# EAGLE schematic DashCam Schematic (EAGLE 8.0.2)
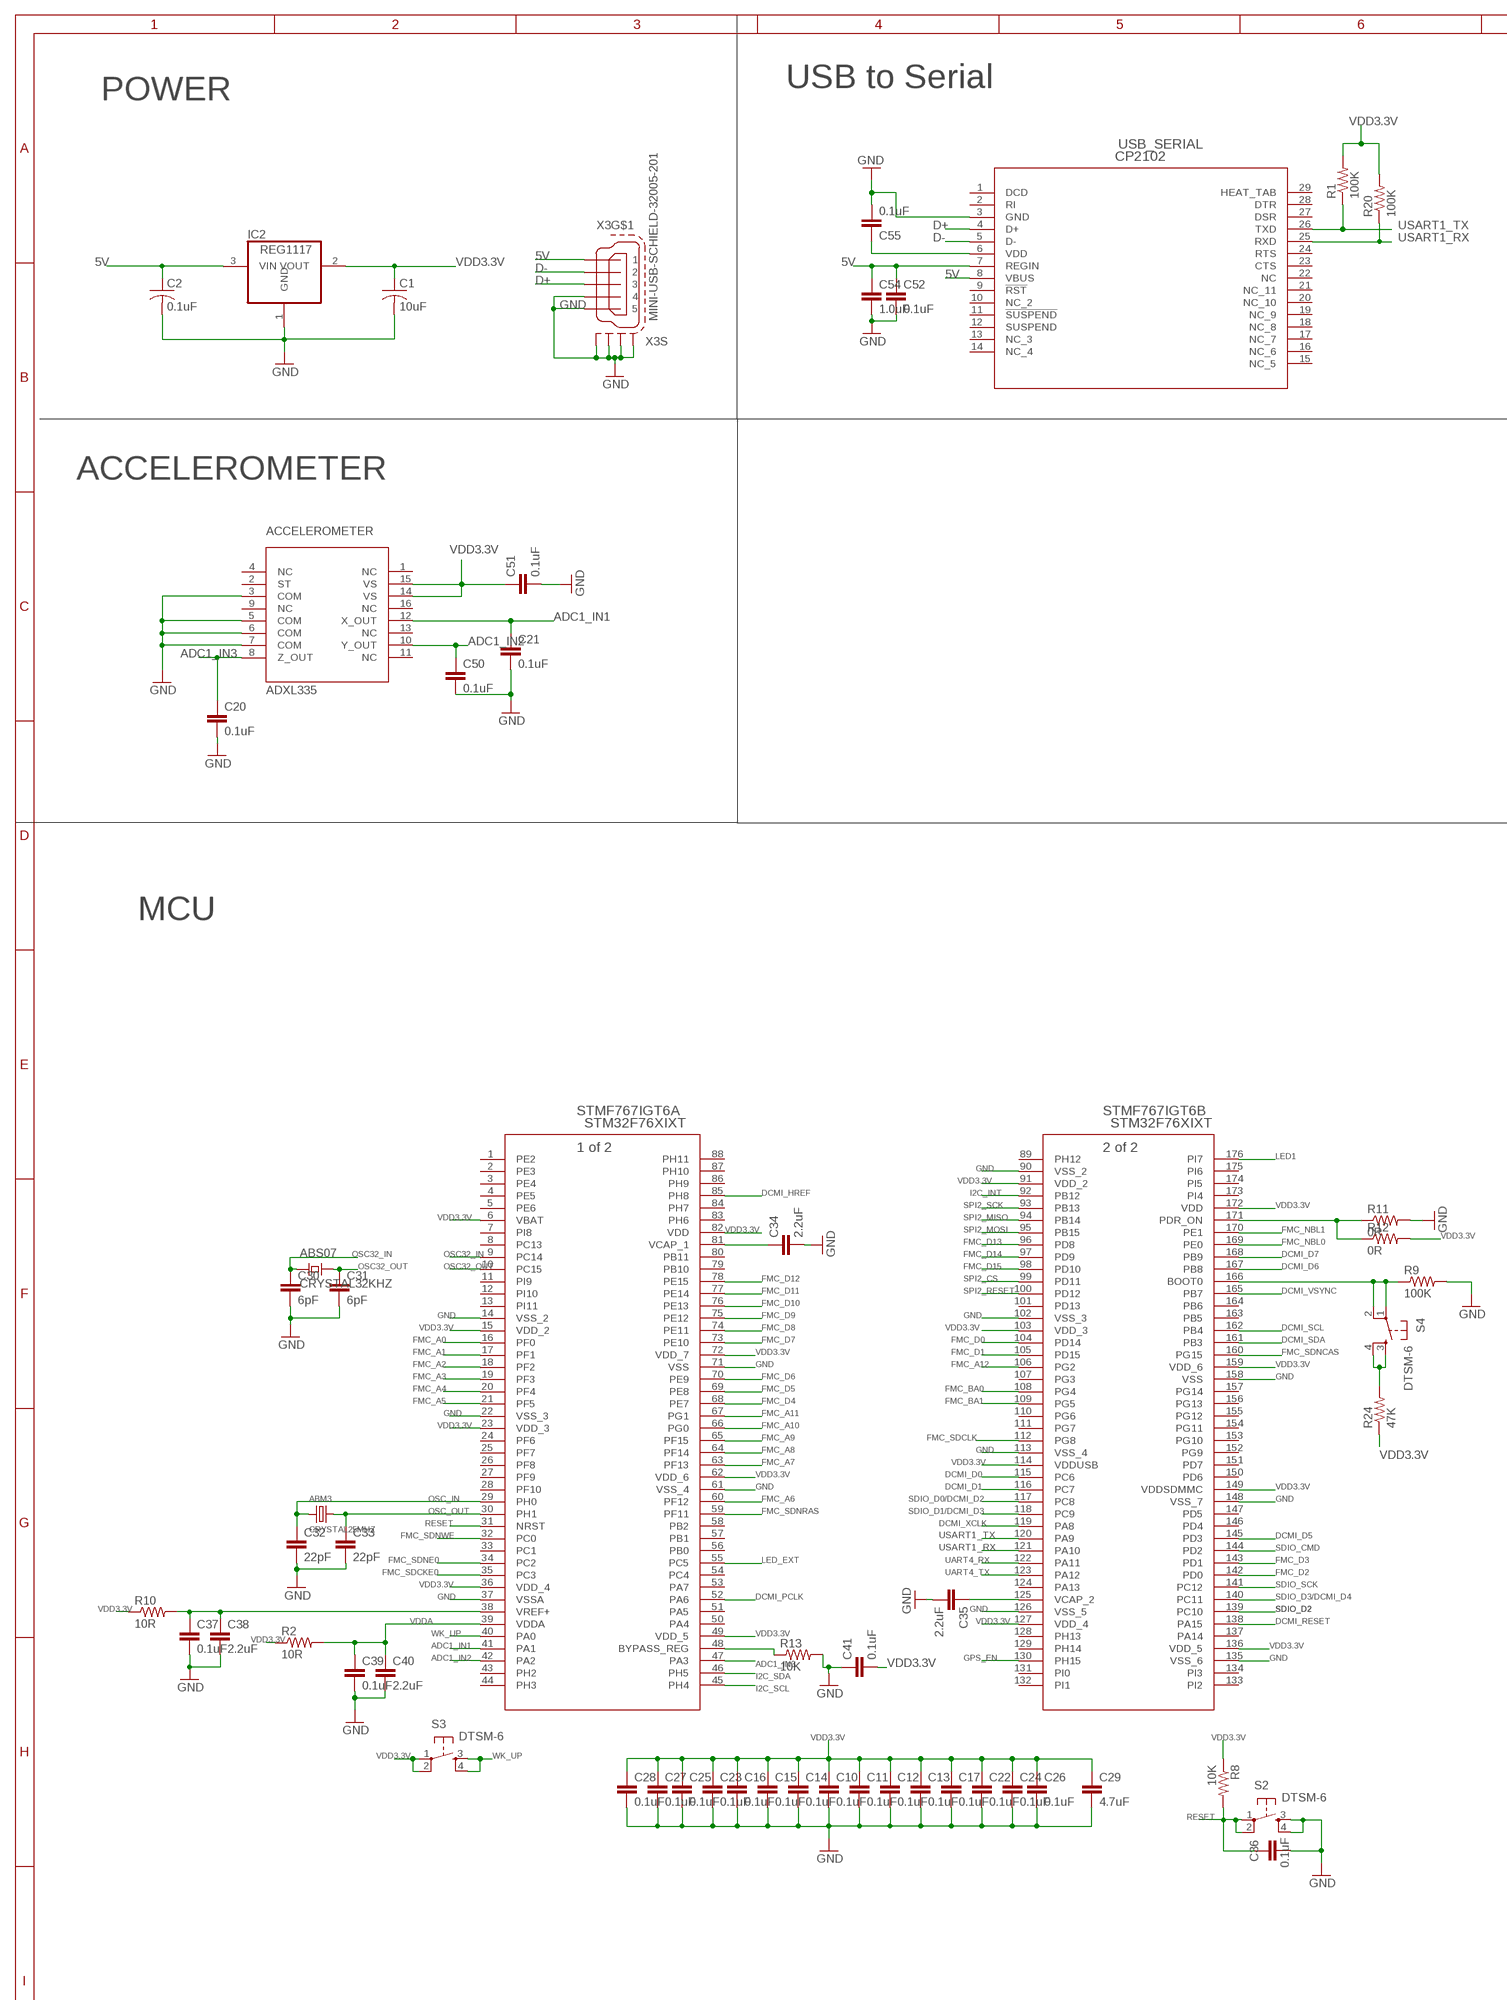
[diagram p0: schematic, sheet 1, part 1 of 2]
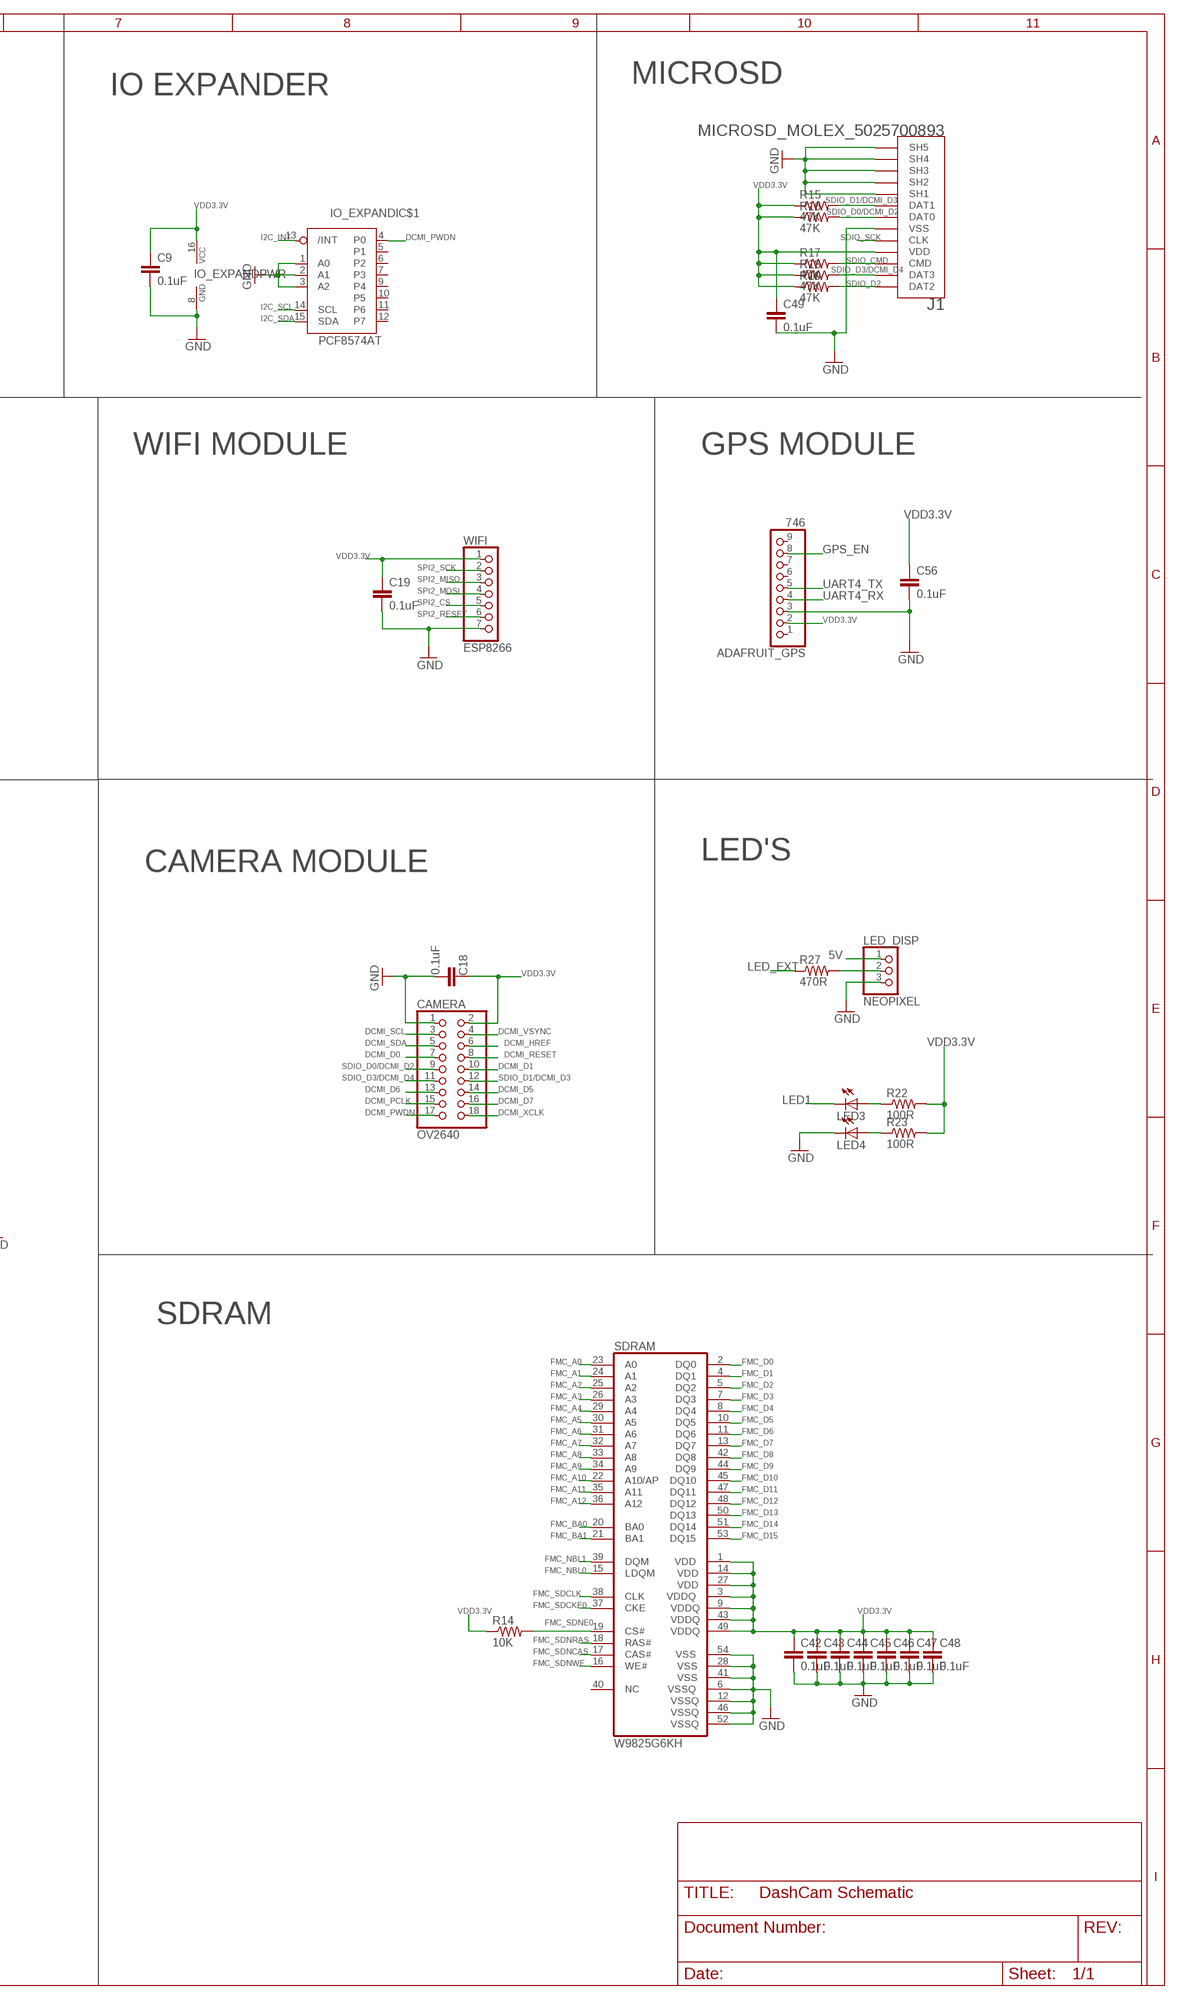
[diagram p1: schematic, sheet 1, part 2 of 2]

## Parts
ABM3  CRYSTAL25MHZ  CRYSTAL.6X3.3MM  [6X3.3MM]
ABS07  CRYSTAL32KHZ  ABSO7  [2-SMD_ABM7]
ACCELEROMETER  ADXL335  [LFCSP16]
ADAFRUIT_GPS  746  PINHD-1X9  [1X09]
C1  10uF  C-USC0805  [C0805]
C2  0.1uF  C-USC0402  [C0402]
C9  0.1uF  C-EUC0402  [C0402]
C10  0.1uF  C-EUC0402  [C0402]
C11  0.1uF  C-EUC0402  [C0402]
C12  0.1uF  C-EUC0402  [C0402]
C13  0.1uF  C-EUC0402  [C0402]
C14  0.1uF  C-EUC0402  [C0402]
C15  0.1uF  C-EUC0402  [C0402]
C16  0.1uF  C-EUC0402  [C0402]
C17  0.1uF  C-EUC0402  [C0402]
C18  0.1uF  C-EUC0402  [C0402]
C19  0.1uF  C-EUC0402  [C0402]
C20  0.1uF  C-EUC0402  [C0402]
C21  0.1uF  C-EUC0402  [C0402]
C22  0.1uF  C-EUC0402  [C0402]
C23  0.1uF  C-EUC0402  [C0402]
C24  0.1uF  C-EUC0402  [C0402]
C25  0.1uF  C-EUC0402  [C0402]
C26  0.1uF  C-EUC0402  [C0402]
C27  0.1uF  C-EUC0402  [C0402]
C28  0.1uF  C-EUC0402  [C0402]
C29  4.7uF  C-EUC0603  [C0603]
C30  6pF  C-EUC0402  [C0402]
C31  6pF  C-EUC0402  [C0402]
C32  22pF  C-EUC0201  [C0201]
C33  22pF  C-EUC0201  [C0201]
C34  2.2uF  C-EUC0805  [C0805]
C35  2.2uF  C-EUC0805  [C0805]
C36  0.1uF  C-EUC0402  [C0402]
C37  0.1uF  C-EUC0402  [C0402]
C38  2.2uF  C-EUC0805  [C0805]
C39  0.1uF  C-EUC0402  [C0402]
C40  2.2uF  C-EUC0805  [C0805]
C41  0.1uF  C-EUC0402  [C0402]
C42  0.1uF  C-EUC0402  [C0402]
C43  0.1uF  C-EUC0402  [C0402]
C44  0.1uF  C-EUC0402  [C0402]
C45  0.1uF  C-EUC0402  [C0402]
C46  0.1uF  C-EUC0402  [C0402]
C47  0.1uF  C-EUC0402  [C0402]
C48  0.1uF  C-EUC0402  [C0402]
C49  0.1uF  C-EUC0402  [C0402]
C50  0.1uF  C-EUC0402  [C0402]
C51  0.1uF  C-EUC0402  [C0402]
C52  0.1uF  C-EUC0402  [C0402]
C54  1.0uF  C-EUC0402  [C0402]
C55  0.1uF  C-EUC0402  [C0402]
C56  0.1uF  C-EUC0402  [C0402]
CAMERA  OV2640  PINHD-2X9/90  [2X09/90]
IC2  REG1117  [SOT223]
IO_EXPAND  PCF8574AT  [SO16]
J1  MICROSD_MOLEX_5025700893  [5025700893]
LED3  LEDCHIP-LED0603  [CHIP-LED0603]
LED4  LEDCHIP-LED0603  [CHIP-LED0603]
LED_DISP  NEOPIXEL  PINHD-1X3  [1X03]
R1  100K  R-US_R0805  [R0805]
R2  10R  R-US_R0603  [R0603]
R8  10K  R-US_R0402  [R0402]
R9  100K  R-US_R0805  [R0805]
R10  10R  R-US_R0603  [R0603]
R11  0R  R-US_R0402  [R0402]
R12  0R  R-US_R0402  [R0402]
R13  10K  R-US_R0402  [R0402]
R14  10K  R-US_R0402  [R0402]
R15  47K  R-US_R0402  [R0402]
R16  47K  R-US_R0402  [R0402]
R17  47K  R-US_R0402  [R0402]
R18  47K  R-US_R0402  [R0402]
R19  47K  R-US_R0402  [R0402]
R20  100K  R-US_R0805  [R0805]
R22  100R  R-US_R0402  [R0402]
R23  100R  R-US_R0402  [R0402]
R24  47K  R-US_R0402  [R0402]
R27  470R  R-US_R0603  [R0603]
S2  DTSM-6  [DTSM-6]
S3  DTSM-6  [DTSM-6]
S4  DTSM-6  [DTSM-6]
SDRAM  W9825G6KH  K4S561632E-TC  [TSOP54]
STMF767IGT6  STM32F76XIXT  [LQFP-176_24X24]
USB_SERIAL  CP2102  [QFN28N5X5-0P5P]
WIFI  ESP8266  PINHD-1X7  [1X07]
X3  MINI-USB-SCHIELD-32005-201  [32005-201]

## Nets
5V: C2.1 C52.1 C54.1 IC2.3(VIN) LED_DISP.1 USB_SERIAL.7(REGIN) USB_SERIAL.8(VBUS) X3.1
ADC1_IN1: ACCELEROMETER.12(X_OUT) C21.1 STMF767IGT6.41(A:PA1)
ADC1_IN2: ACCELEROMETER.10(Y_OUT) C50.1 STMF767IGT6.42(A:PA2)
ADC1_IN3: ACCELEROMETER.8(Z_OUT) C20.1 STMF767IGT6.47(A:PA3)
D+: USB_SERIAL.4(D+) X3.3
D-: USB_SERIAL.5(D-) X3.2
DCMI_D0: CAMERA.7 STMF767IGT6.115(B:PC6)
DCMI_D1: CAMERA.10 STMF767IGT6.116(B:PC7)
DCMI_D5: CAMERA.14 STMF767IGT6.145(B:PD3)
DCMI_D6: CAMERA.13 STMF767IGT6.167(B:PB8)
DCMI_D7: CAMERA.16 STMF767IGT6.168(B:PB9)
DCMI_HREF: CAMERA.6 STMF767IGT6.85(A:PH8)
DCMI_PCLK: CAMERA.15 STMF767IGT6.52(A:PA6)
DCMI_PWDN: CAMERA.17 IO_EXPAND.4(IC$1:P0)
DCMI_RESET: CAMERA.8 STMF767IGT6.138(B:PA15)
DCMI_SCL: CAMERA.3 STMF767IGT6.162(B:PB4)
DCMI_SDA: CAMERA.5 STMF767IGT6.161(B:PB3)
DCMI_VSYNC: CAMERA.4 STMF767IGT6.165(B:PB7)
DCMI_XCLK: CAMERA.18 STMF767IGT6.119(B:PA8)
FMC_A0: SDRAM.23(A0) STMF767IGT6.16(A:PF0)
FMC_A1: SDRAM.24(A1) STMF767IGT6.17(A:PF1)
FMC_A2: SDRAM.25(A2) STMF767IGT6.18(A:PF2)
FMC_A3: SDRAM.26(A3) STMF767IGT6.19(A:PF3)
FMC_A4: SDRAM.29(A4) STMF767IGT6.20(A:PF4)
FMC_A5: SDRAM.30(A5) STMF767IGT6.21(A:PF5)
FMC_A6: SDRAM.31(A6) STMF767IGT6.60(A:PF12)
FMC_A7: SDRAM.32(A7) STMF767IGT6.63(A:PF13)
FMC_A8: SDRAM.33(A8) STMF767IGT6.64(A:PF14)
FMC_A9: SDRAM.34(A9) STMF767IGT6.65(A:PF15)
FMC_A10: SDRAM.22(A10/AP) STMF767IGT6.66(A:PG0)
FMC_A11: SDRAM.35(A11) STMF767IGT6.67(A:PG1)
FMC_A12: SDRAM.36(A12) STMF767IGT6.106(B:PG2)
FMC_BA0: SDRAM.20(BA0) STMF767IGT6.108(B:PG4)
FMC_BA1: SDRAM.21(BA1) STMF767IGT6.109(B:PG5)
FMC_D0: SDRAM.2(DQ0) STMF767IGT6.104(B:PD14)
FMC_D1: SDRAM.4(DQ1) STMF767IGT6.105(B:PD15)
FMC_D2: SDRAM.5(DQ2) STMF767IGT6.142(B:PD0)
FMC_D3: SDRAM.7(DQ3) STMF767IGT6.143(B:PD1)
FMC_D4: SDRAM.8(DQ4) STMF767IGT6.68(A:PE7)
FMC_D5: SDRAM.10(DQ5) STMF767IGT6.69(A:PE8)
FMC_D6: SDRAM.11(DQ6) STMF767IGT6.70(A:PE9)
FMC_D7: SDRAM.13(DQ7) STMF767IGT6.73(A:PE10)
FMC_D8: SDRAM.42(DQ8) STMF767IGT6.74(A:PE11)
FMC_D9: SDRAM.44(DQ9) STMF767IGT6.75(A:PE12)
FMC_D10: SDRAM.45(DQ10) STMF767IGT6.76(A:PE13)
FMC_D11: SDRAM.47(DQ11) STMF767IGT6.77(A:PE14)
FMC_D12: SDRAM.48(DQ12) STMF767IGT6.78(A:PE15)
FMC_D13: SDRAM.50(DQ13) STMF767IGT6.96(B:PD8)
FMC_D14: SDRAM.51(DQ14) STMF767IGT6.97(B:PD9)
FMC_D15: SDRAM.53(DQ15) STMF767IGT6.98(B:PD10)
FMC_NBL0: SDRAM.15(LDQM) STMF767IGT6.169(B:PE0)
FMC_NBL1: SDRAM.39(DQM) STMF767IGT6.170(B:PE1)
FMC_SDCKE0: SDRAM.37(CKE) STMF767IGT6.35(A:PC3)
FMC_SDCLK: SDRAM.38(CLK) STMF767IGT6.112(B:PG8)
FMC_SDNCAS: SDRAM.17(CAS#) STMF767IGT6.160(B:PG15)
FMC_SDNE0: R14.2 SDRAM.19(CS#) STMF767IGT6.34(A:PC2)
FMC_SDNRAS: SDRAM.18(RAS#) STMF767IGT6.59(A:PF11)
FMC_SDNWE: SDRAM.16(WE#) STMF767IGT6.32(A:PC0)
GND: ACCELEROMETER.3(COM) ACCELEROMETER.5(COM) ACCELEROMETER.6(COM) ACCELEROMETER.7(COM) ADAFRUIT_GPS.3 C1.2 C2.2 C9.2 C10.2 C11.2 C12.2 C13.2 C14.2 C15.2 C16.2 C17.2 C18.2 C19.2 C20.2 C21.2 C22.2 C23.2 C24.2 C25.2 C26.2 C27.2 C28.2 C29.2 C30.2 C31.2 C32.2 C33.2 C34.2 C35.2 C36.2 C37.2 C38.2 C39.2 C40.2 C41.1 C42.2 C43.2 C44.2 C45.2 C46.2 C47.2 C48.2 C49.2 C50.2 C51.2 C52.2 C54.2 C55.2 C56.2 CAMERA.1 IC2.1(GND) IO_EXPAND.1(IC$1:A0) IO_EXPAND.2(IC$1:A1) IO_EXPAND.3(IC$1:A2) IO_EXPAND.8(PWR:GND) J1.GND0(SH1) J1.GND1(SH2) J1.GND2(SH3) J1.GND3(SH4) J1.GND4(SH5) J1.P$6(VSS) LED4.C LED_DISP.3 R9.2 R11.2 R13.2 S2.3 S2.4 SDRAM.6(VSSQ) SDRAM.12(VSSQ) SDRAM.28(VSS) SDRAM.41(VSS) SDRAM.46(VSSQ) SDRAM.52(VSSQ) SDRAM.54(VSS) STMF767IGT6.14(A:VSS_2) STMF767IGT6.22(A:VSS_3) STMF767IGT6.37(A:VSSA) STMF767IGT6.61(A:VSS_4) STMF767IGT6.71(A:VSS) STMF767IGT6.90(B:VSS_2) STMF767IGT6.102(B:VSS_3) STMF767IGT6.113(B:VSS_4) STMF767IGT6.126(B:VSS_5) STMF767IGT6.135(B:VSS_6) STMF767IGT6.148(B:VSS_7) STMF767IGT6.158(B:VSS) USB_SERIAL.3(GND) WIFI.7 X3.4 X3.5 X3.M1(S:S1) X3.M2(S:S2) X3.M3(S:S3) X3.M4(S:S4)
GPS_EN: ADAFRUIT_GPS.8 STMF767IGT6.130(B:PH15)
I2C_INT: IO_EXPAND.13(IC$1:/INT) STMF767IGT6.92(B:PB12)
I2C_SCL: IO_EXPAND.14(IC$1:SCL) STMF767IGT6.45(A:PH4)
I2C_SDA: IO_EXPAND.15(IC$1:SDA) STMF767IGT6.46(A:PH5)
LED1: LED3.C STMF767IGT6.176(B:PI7)
LED_EXT: R27.1 STMF767IGT6.55(A:PC5)
N$1: R13.1 STMF767IGT6.48(A:BYPASS_REG)
N$2: R9.1 S4.1 S4.2 STMF767IGT6.166(B:BOOT0)
N$4: C55.1 USB_SERIAL.6(VDD)
N$5: LED3.A R22.1
N$6: C34.1 STMF767IGT6.81(A:VCAP_1)
N$9: C35.1 STMF767IGT6.125(B:VCAP_2)
N$10: R11.1 R12.1 STMF767IGT6.171(B:PDR_ON)
N$11: LED4.A R23.1
N$13: R24.2 S4.3 S4.4
N$14: LED_DISP.2 R27.2
N$24: C37.1 C38.1 R10.2 STMF767IGT6.38(A:VREF+)
OSC32_IN: ABS07.P$1 C30.1 STMF767IGT6.9(A:PC14)
OSC32_OUT: ABS07.P$2 C31.1 STMF767IGT6.10(A:PC15)
OSC_IN: ABM3.1 C32.1 STMF767IGT6.29(A:PH0)
OSC_OUT: ABM3.2 C33.1 STMF767IGT6.30(A:PH1)
RESET: C36.1 R8.2 S2.1 S2.2 STMF767IGT6.31(A:NRST)
SDIO_CMD: J1.P$3(CMD) R17.2 STMF767IGT6.144(B:PD2)
SDIO_D0/DCMI_D2: CAMERA.9 J1.P$7(DAT0) R16.2 STMF767IGT6.117(B:PC8)
SDIO_D1/DCMI_D3: CAMERA.12 J1.P$8(DAT1) R15.2 STMF767IGT6.118(B:PC9)
SDIO_D2: J1.P$1(DAT2) R19.2 STMF767IGT6.139(B:PC10)
SDIO_D3/DCMI_D4: CAMERA.11 J1.P$2(DAT3) R18.2 STMF767IGT6.140(B:PC11)
SDIO_SCK: J1.P$5(CLK) STMF767IGT6.141(B:PC12)
SPI2_CS: STMF767IGT6.99(B:PD11) WIFI.5
SPI2_MISO: STMF767IGT6.94(B:PB14) WIFI.3
SPI2_MOSI: STMF767IGT6.95(B:PB15) WIFI.4
SPI2_RESET: STMF767IGT6.100(B:PD12) WIFI.6
SPI2_SCK: STMF767IGT6.93(B:PB13) WIFI.2
UART4_RX: ADAFRUIT_GPS.4 STMF767IGT6.122(B:PA11)
UART4_TX: ADAFRUIT_GPS.5 STMF767IGT6.123(B:PA12)
USART1_RX: R20.1 STMF767IGT6.121(B:PA10) USB_SERIAL.25(RXD)
USART1_TX: R1.1 STMF767IGT6.120(B:PA9) USB_SERIAL.26(TXD)
VDD3.3V: ACCELEROMETER.14(VS) ACCELEROMETER.15(VS) ADAFRUIT_GPS.2 C1.1 C9.1 C10.1 C11.1 C12.1 C13.1 C14.1 C15.1 C16.1 C17.1 C18.1 C19.1 C22.1 C23.1 C24.1 C25.1 C26.1 C27.1 C28.1 C29.1 C41.2 C42.1 C43.1 C44.1 C45.1 C46.1 C47.1 C48.1 C49.1 C51.1 C56.1 CAMERA.2 IC2.2(VOUT) IO_EXPAND.16(PWR:VCC) J1.P$4(VDD) R1.2 R2.1 R8.1 R10.1 R12.2 R14.1 R15.1 R16.1 R17.1 R18.1 R19.1 R20.2 R22.2 R23.2 R24.1 S3.1 S3.2 SDRAM.1(VDD) SDRAM.3(VDDQ) SDRAM.9(VDDQ) SDRAM.14(VDD) SDRAM.27(VDD) SDRAM.43(VDDQ) SDRAM.49(VDDQ) STMF767IGT6.6(A:VBAT) STMF767IGT6.15(A:VDD_2) STMF767IGT6.23(A:VDD_3) STMF767IGT6.36(A:VDD_4) STMF767IGT6.49(A:VDD_5) STMF767IGT6.62(A:VDD_6) STMF767IGT6.72(A:VDD_7) STMF767IGT6.82(A:VDD) STMF767IGT6.91(B:VDD_2) STMF767IGT6.103(B:VDD_3) STMF767IGT6.114(B:VDDUSB) STMF767IGT6.127(B:VDD_4) STMF767IGT6.136(B:VDD_5) STMF767IGT6.149(B:VDDSDMMC) STMF767IGT6.159(B:VDD_6) STMF767IGT6.172(B:VDD) WIFI.1
VDDA: C39.1 C40.1 R2.2 STMF767IGT6.39(A:VDDA)
WK_UP: S3.3 S3.4 STMF767IGT6.40(A:PA0)
Unconnected: ACCELEROMETER.1(NC) ACCELEROMETER.2(ST) ACCELEROMETER.4(NC) ACCELEROMETER.9(NC) ACCELEROMETER.11(NC) ACCELEROMETER.13(NC) ACCELEROMETER.16(NC) ADAFRUIT_GPS.1 ADAFRUIT_GPS.6 ADAFRUIT_GPS.7 ADAFRUIT_GPS.9 IO_EXPAND.5(IC$1:P1) IO_EXPAND.6(IC$1:P2) IO_EXPAND.7(IC$1:P3) IO_EXPAND.9(IC$1:P4) IO_EXPAND.10(IC$1:P5) IO_EXPAND.11(IC$1:P6) IO_EXPAND.12(IC$1:P7) SDRAM.40(NC) STMF767IGT6.1(A:PE2) STMF767IGT6.2(A:PE3) STMF767IGT6.3(A:PE4) STMF767IGT6.4(A:PE5) STMF767IGT6.5(A:PE6) STMF767IGT6.7(A:PI8) STMF767IGT6.8(A:PC13) STMF767IGT6.11(A:PI9) STMF767IGT6.12(A:PI10) STMF767IGT6.13(A:PI11) STMF767IGT6.24(A:PF6) STMF767IGT6.25(A:PF7) STMF767IGT6.26(A:PF8) STMF767IGT6.27(A:PF9) STMF767IGT6.28(A:PF10) STMF767IGT6.33(A:PC1) STMF767IGT6.43(A:PH2) STMF767IGT6.44(A:PH3) STMF767IGT6.50(A:PA4) STMF767IGT6.51(A:PA5) STMF767IGT6.53(A:PA7) STMF767IGT6.54(A:PC4) STMF767IGT6.56(A:PB0) STMF767IGT6.57(A:PB1) STMF767IGT6.58(A:PB2) STMF767IGT6.79(A:PB10) STMF767IGT6.80(A:PB11) STMF767IGT6.83(A:PH6) STMF767IGT6.84(A:PH7) STMF767IGT6.86(A:PH9) STMF767IGT6.87(A:PH10) STMF767IGT6.88(A:PH11) STMF767IGT6.89(B:PH12) STMF767IGT6.101(B:PD13) STMF767IGT6.107(B:PG3) STMF767IGT6.110(B:PG6) STMF767IGT6.111(B:PG7) STMF767IGT6.124(B:PA13) STMF767IGT6.128(B:PH13) STMF767IGT6.129(B:PH14) STMF767IGT6.131(B:PI0) STMF767IGT6.132(B:PI1) STMF767IGT6.133(B:PI2) STMF767IGT6.134(B:PI3) STMF767IGT6.137(B:PA14) STMF767IGT6.146(B:PD4) STMF767IGT6.147(B:PD5) STMF767IGT6.150(B:PD6) STMF767IGT6.151(B:PD7) STMF767IGT6.152(B:PG9) STMF767IGT6.153(B:PG10) STMF767IGT6.154(B:PG11) STMF767IGT6.155(B:PG12) STMF767IGT6.156(B:PG13) STMF767IGT6.157(B:PG14) STMF767IGT6.163(B:PB5) STMF767IGT6.164(B:PB6) STMF767IGT6.173(B:PI4) STMF767IGT6.174(B:PI5) STMF767IGT6.175(B:PI6) USB_SERIAL.1(DCD) USB_SERIAL.2(RI) USB_SERIAL.9(!RST) USB_SERIAL.10(NC_2) USB_SERIAL.11(!SUSPEND) USB_SERIAL.12(SUSPEND) USB_SERIAL.13(NC_3) USB_SERIAL.14(NC_4) USB_SERIAL.15(NC_5) USB_SERIAL.16(NC_6) USB_SERIAL.17(NC_7) USB_SERIAL.18(NC_8) USB_SERIAL.19(NC_9) USB_SERIAL.20(NC_10) USB_SERIAL.21(NC_11) USB_SERIAL.22(NC) USB_SERIAL.23(CTS) USB_SERIAL.24(RTS) USB_SERIAL.27(DSR) USB_SERIAL.28(DTR) USB_SERIAL.29(HEAT_TAB)

## Notes on the sheet
- USB to Serial | MICROSD
- POWER | IO EXPANDER
- ACCELEROMETER | WIFI MODULE | GPS MODULE
- LED'S
- MCU | CAMERA MODULE
- SDRAM

## Library data of the parts
ABM3 = abracon:CRYSTAL
ABS07 = ABS07:ABSO7: ABS07 - 16MHz crystal Datasheet: http://www.abracon.com/Resonators/ABS07-120-32.768kHz-T.pdf
ACCELEROMETER = adxl335:ADXL335: ADXL335 Package: LFCSP16 Descripton: small, low power, 3-Axis ±3g Accelerometer Author: Braekevelt Wim Student @ KHBO Ostend Mail : braekevelt.wim@telenet.be <mailto:braekevelt.wim@telenet.be?subject=ADXL335 remark>; IC: ADXL335
ADAFRUIT_GPS = pinhead:PINHD-1X9: PIN HEADER
C1 C2 = rcl:C-US: CAPACITOR, American symbol
C9-C52 C54-C56 = rcl:C-EU: CAPACITOR, European symbol
CAMERA = pinhead:PINHD-2X9: PIN HEADER
IC2 = burr-brown:REG1117: 800mA and 1A Low Dropout (LDO) Positive Regulator 1.8V, 2.5V, 2.85V, 3.3V, 5V, and Adj; MPN: REG1117; OC_FARNELL: 1097566; OC_NEWARK: 14P6981
IO_EXPAND = PCF8574T:PCF8574: Remote 8-Bit I/O Expander for I²C Bus
J1 = j_microsd_molex_5025700893:MICROSD_MOLEX_5025700893: Molex 5025700893 MicroSD Normal Mount SMT Connector
LED3 LED4 = led:LED: LED OSRAM: - CHIPLED LG R971, LG N971, LY N971, LG Q971, LY Q971, LO R971, LY R971 LH N974, LH R974 LS Q976, LO Q976, LY Q976 LO Q996 - Hyper CHIPLED LW Q18S LB Q993, LB Q99A, LB R99A - SideLED LS A670, LO A670, LY A670, LG A670, LP A670 LB A673, LV A673, LT A673, LW A673 LH A674 LY A675 LS A676, LA A676, LO A676, LY A676, LW A676 LS A679, LY A679, LG A679 - Hyper Micro SIDELED® LS Y876, LA Y876, LO Y876, LY Y876 LT Y87S - SmartLED LW L88C, LW L88S LB L89C, LB L89S, LG L890 LS L89K, LO L89K, LY L89K LS L896, LA L896, LO L896, LY L896 - TOPLED LS T670, LO T670, LY T670, LG T670, LP T670 LSG T670, LSP T670, LSY T670, LOP T670, LYG T670 LG T671, LOG T671, LSG T671 LB T673, LV T673, LT T673, LW T673 LH T674 LS T676, LA T676, LO T676, LY T676, LB T676, LH T676, LSB T676, LW T676 LB T67C, LV T67C, LT T67C, LS T67K, LO T67K, LY T67K, LW E67C LS E67B, LA E67B, LO E67B, LY E67B, LB E67C, LV E67C, LT E67C LW T67C LS T679, LY T679, LG T679 LS T770, LO T770, LY T770, LG T770, LP T770 LB T773, LV T773, LT T773, LW T773 LH T774 LS E675, LA E675, LY E675, LS T675 LS T776, LA T776, LO T776, LY T776, LB T776 LHGB T686 LT T68C, LB T68C - Hyper Mini TOPLED® LB M676 - Mini TOPLED Santana® LG M470 LS M47K, LO M47K, LY M47K Source: http://www.osram.convergy.de LUXEON: - LUMILED® LXK2-PW12-R00, LXK2-PW12-S00, LXK2-PW14-U00, LXK2-PW14-V00 LXK2-PM12-R00, LXK2-PM12-S00, LXK2-PM14-U00 LXK2-PE12-Q00, LXK2-PE12-R00, LXK2-PE12-S00, LXK2-PE14-T00, LXK2-PE14-U00 LXK2-PB12-K00, LXK2-PB12-L00, LXK2-PB12-M00, LXK2-PB14-N00, LXK2-PB14-P00, LXK2-PB14-Q00 LXK2-PR12-L00, LXK2-PR12-M00, LXK2-PR14-Q00, LXK2-PR14-R00 LXK2-PD12-Q00, LXK2-PD12-R00, LXK2-PD12-S00 LXK2-PH12-R00, LXK2-PH12-S00 LXK2-PL12-P00, LXK2-PL12-Q00, LXK2-PL12-R00 Source: www.luxeon.com KINGBRIGHT: KA-3528ASYC Source: www.kingbright.com
LED_DISP = pinhead:PINHD-1X3: PIN HEADER
R1 R2 R8-R20 R22-R24 R27 = resistor:R-US_: RESISTOR, American symbol
S2-S4 = switch-tact:DTSM-6
SDRAM = sdram:K4S561632E-TC: SDRAM 4M x 16bit x 4 banks synchronous DRAM. 256 Mbit SDRAM.
STMF767IGT6 = stm32f767:STM32F76XIXT; MANUFACTURER_PART_NUMBER: STM32F76XIXT; VENDOR: STMicroelectronics
USB_SERIAL = CP2102N:CP2102; MANUFACTURER_PART_NUMBER: CP2102; VENDOR: Silicon Labs
WIFI = pinhead:PINHD-1X7: PIN HEADER
X3 = con-cypressindustries:MINI-USB-SCHIELD-: MINI USB-B Conector Source: www.cypressindustries.com; OC_FARNELL: unknown; OC_NEWARK: unknown